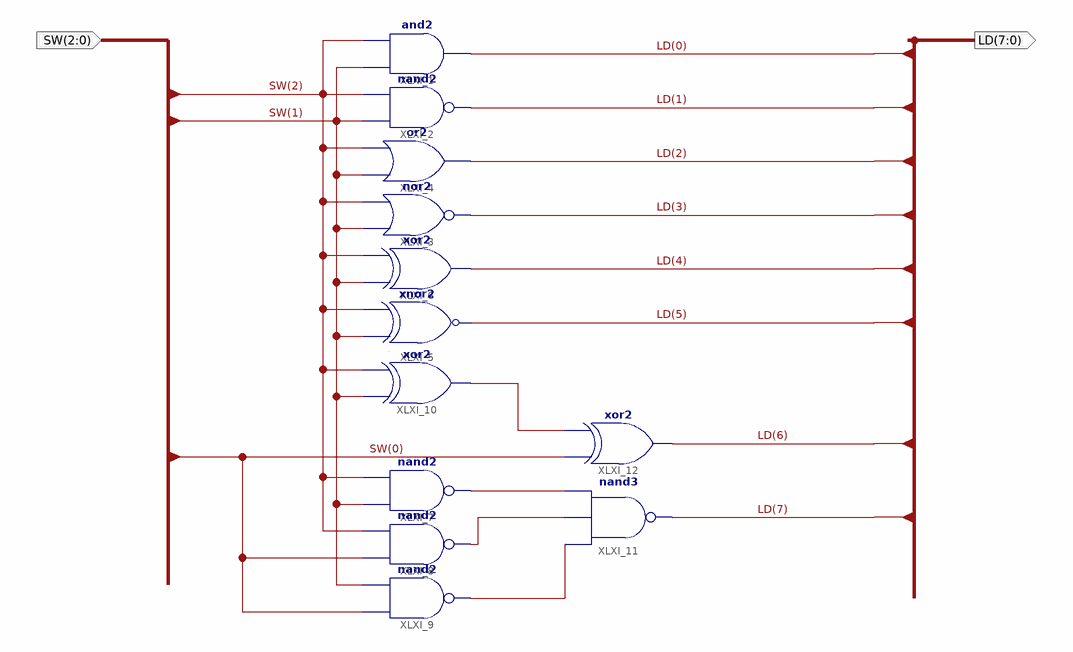
[diagram p0: schematic sheet 1]
// Xilinx ISE schematic gate2.sch (spartan3e) as structural Verilog: 12 symbols, 2 ports
module gate2 (
  input  [2:0] SW,
  output [7:0] LD
);

  wire XLXN_1, XLXN_2, XLXN_3, XLXN_4;

  and XLXI_1 (LD[0], SW[1], SW[2]);
  or XLXI_4 (LD[2], SW[1], SW[2]);
  nor XLXI_3 (LD[3], SW[1], SW[2]);
  xor XLXI_6 (LD[4], SW[1], SW[2]);
  xnor XLXI_5 (LD[5], SW[1], SW[2]);
  xor XLXI_12 (LD[6], SW[0], XLXN_1);
  xor XLXI_10 (XLXN_1, SW[1], SW[2]);
  nand XLXI_9 (XLXN_4, SW[0], SW[1]);
  nand XLXI_7 (XLXN_2, SW[1], SW[2]);
  nand XLXI_8 (XLXN_3, SW[0], SW[2]);
  nand XLXI_11 (LD[7], XLXN_4, XLXN_3, XLXN_2);
  nand XLXI_2 (LD[1], SW[1], SW[2]);
endmodule
